# EAGLE schematic countercat_rev2 (EAGLE 6.5.0)
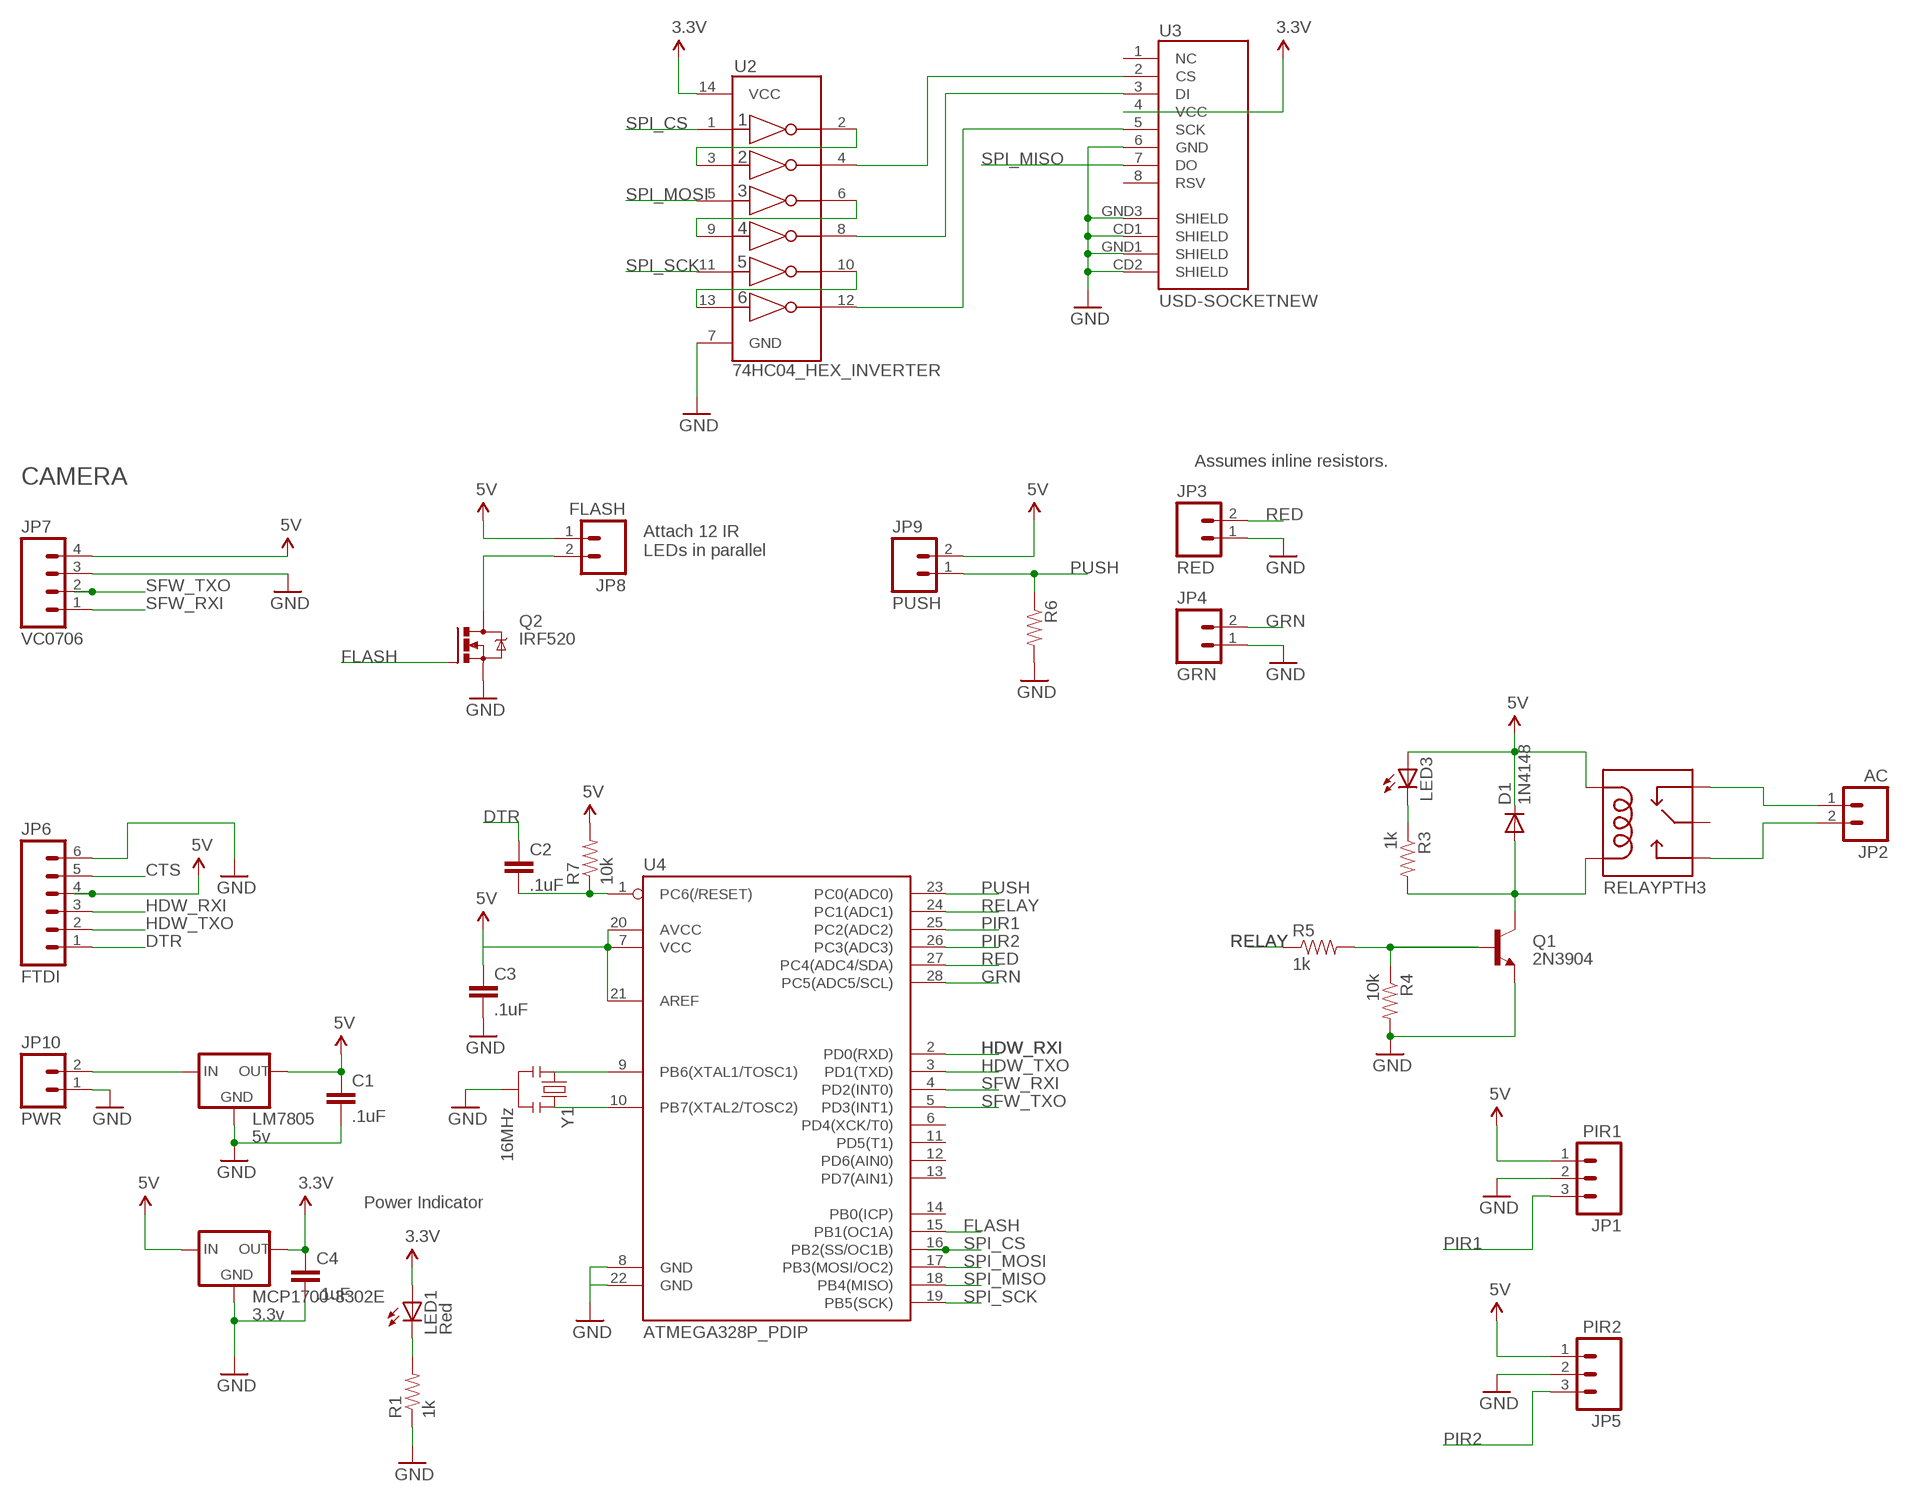
[diagram p0: schematic, sheet 1]

## Parts
C1  .1uF  CAPPTH2  [CAP-PTH-SMALL2]
C2  .1uF  CAPPTH2  [CAP-PTH-SMALL2]
C3  .1uF  CAPPTH2  [CAP-PTH-SMALL2]
C4  .1uF  CAPPTH2  [CAP-PTH-SMALL2]
D1  1N4148  DIODEPTH  [DIODE-1N4001]
JP1  PIR1  M03POLAR  [MOLEX-1X3]
JP2  AC  M025MM  [SCREWTERMINAL-5MM-2]
JP3  RED  M02POLAR  [MOLEX-1X2]
JP4  GRN  M02POLAR  [MOLEX-1X2]
JP5  PIR2  M03POLAR  [MOLEX-1X3]
JP6  FTDI  M06LOCK  [1X06_LOCK]
JP7  VC0706  M04POLAR  [MOLEX-1X4]
JP8  FLASH  M02POLAR  [MOLEX-1X2]
JP9  PUSH  M02POLAR  [MOLEX-1X2]
JP10  PWR  M02POLAR  [MOLEX-1X2]
LED1  Red  LED3MM  [LED3MM]
LED3  LED3MM  [LED3MM]
LM7805  5v  V_REG_78XXSINK  [TO220-IGO]
MCP1700-3302E  3.3v  V_REG_78XXTO-92_UNTESTED  [TO-92]
Q1  2N3904  TRANSISTOR_NPNTO92  [TO-92]
Q2  IRF520  [TO220BV]
R1  1k  RESISTORPTH-1/4W  [AXIAL-0.4]
R3  1k  RESISTORPTH-1/4W  [AXIAL-0.4]
R4  10k  RESISTORPTH-1/4W  [AXIAL-0.4]
R5  1k  RESISTORPTH-1/4W  [AXIAL-0.4]
R6  RESISTORPTH-1/4W  [AXIAL-0.4]
R7  10k  RESISTORPTH-1/4W  [AXIAL-0.4]
U2  74HC04_HEX_INVERTER  [DIL14]
U3  USD-SOCKETNEW  [MICRO-SD-SOCKET-PP]
U4  ATMEGA328P_PDIP  [DIL28-3]
U$2  RELAYPTH3  [RELAY-T9A-2]
Y1  16MHz  RESONATORPTH  [RESONATOR-PTH]

## Nets
3.3V: C4.1 LED1.A MCP1700-3302E.3(OUT) U2.14(VCC) U3.4(VCC)
5V: C1.1 D1.C JP1.1 JP5.1 JP6.4 JP7.4 JP8.1 JP9.2 LED3.A LM7805.OUT MCP1700-3302E.2(IN) R7.P$2 U$2.COIL1
CTS: JP6.5
DTR: C2.1 C2.2 JP6.1 R7.P$1 U4.1(PC6(/RESET))
FLASH: Q2.G U4.15(PB1(OC1A))
GND: C1.2 C3.2 C4.2 JP1.2 JP3.1 JP4.1 JP5.2 JP6.6 JP7.3 JP10.1 LM7805.GND MCP1700-3302E.1(GND) Q1.1(E) Q2.S R1.P$1 R4.P$2 R6.P$2 U2.7(GND) U3.6(GND) U3.CD1(SHIELD) U3.CD2(SHIELD) U3.GND1(SHIELD) U3.GND3(SHIELD) U4.8(GND) U4.22(GND) Y1.2
GRN: JP4.2 U4.28(PC5(ADC5/SCL))
HDW_RXI: JP6.3 U4.2(PD0(RXD))
HDW_TXO: JP6.2 U4.3(PD1(TXD))
N$1: LED3.K(C) R3.P$1
N$3: U4.9(PB6(XTAL1/TOSC1)) Y1.1
N$4: JP8.2 Q2.D
N$5: U2.2(1Y) U2.3(2A)
N$6: JP2.1 U$2.NC
N$7: U4.10(PB7(XTAL2/TOSC2)) Y1.3
N$8: U4.7(VCC) U4.20(AVCC) U4.21(AREF)
N$9: JP2.2 U$2.NO
N$10: D1.A Q1.3(C) R3.P$2 U$2.COIL2
N$11: Q1.2(B) R4.P$1 R5.P$2
N$12: C3.1
N$13: U2.8(4Y) U3.3(DI)
N$14: LED1.K(C) R1.P$2
N$15: U2.12(6Y) U3.5(SCK)
N$16: U2.6(3Y) U2.9(4A)
N$17: U2.10(5Y) U2.13(6A)
N$20: U2.4(2Y) U3.2(CS)
PIR1: JP1.3 U4.25(PC2(ADC2))
PIR2: JP5.3 U4.26(PC3(ADC3))
PUSH: JP9.1 R6.P$1 U4.23(PC0(ADC0))
RED: JP3.2 U4.27(PC4(ADC4/SDA))
RELAY: R5.P$1 U4.24(PC1(ADC1))
SFW_RXI: JP7.1 U4.4(PD2(INT0))
SFW_TXO: JP7.2 U4.5(PD3(INT1))
SPI_CS: U2.1(1A) U4.16(PB2(SS/OC1B))
SPI_MISO: U3.7(DO) U4.18(PB4(MISO))
SPI_MOSI: U2.5(3A) U4.17(PB3(MOSI/OC2))
SPI_SCK: U2.11(5A) U4.19(PB5(SCK))
VB: JP10.2 LM7805.IN
Unconnected: U3.1(NC) U3.8(RSV) U4.6(PD4(XCK/T0)) U4.11(PD5(T1)) U4.12(PD6(AIN0)) U4.13(PD7(AIN1)) U4.14(PB0(ICP)) U$2.MAIN

## Notes on the sheet
- Assumes inline resistors.
- CAMERA
- Attach 12 IR
  LEDs in parallel
- Power Indicator

## Library data of the parts
C1-C4 = SparkFun-Capacitors:CAP: Capacitor Standard 0603 ceramic capacitor, and 0.1" leaded capacitor.
D1 = SparkFun:DIODE: Diode These are standard reverse protection diodes and small signal diodes. SMA package can handle up to about 1A. SOD-323 can handle about 200mA. What the SOD-323 package when ordering, there are some mfgs out there that are 5-pin packages.
JP1 JP5 = SparkFun:M03: Header 3 Standard 3-pin 0.1" header. Use with straight break away headers (SKU : PRT-00116), right angle break away headers (PRT-00553), swiss pins (PRT-00743), machine pins (PRT-00117), and female headers (PRT-00115). Molex polarized connector foot print use with SKU : PRT-08232 with associated crimp pins and housings.
JP2 = NickDC2011Breakouts:M02: Header 2 Standard 2-pin 0.1" header. Use with straight break away headers (SKU : PRT-00116), right angle break away headers (PRT-00553), swiss pins (PRT-00743), machine pins (PRT-00117), and female headers (PRT-00115). Molex polarized connector foot print use with SKU : PRT-08233 with associated crimp pins and housings.
JP3 JP4 JP8-JP10 = SparkFun:M02: Header 2 Standard 2-pin 0.1" header. Use with straight break away headers (SKU : PRT-00116), right angle break away headers (PRT-00553), swiss pins (PRT-00743), machine pins (PRT-00117), and female headers (PRT-00115). Molex polarized connector foot print use with SKU : PRT-08233 with associated crimp pins and housings.
JP6 = NickDC2011Breakouts:M06: Header 6 Standard 6-pin 0.1" header. Use with straight break away headers (SKU : PRT-00116), right angle break away headers (PRT-00553), swiss pins (PRT-00743), machine pins (PRT-00117), and female headers (PRT-00115). Molex polarized connector foot print use with SKU : PRT-08094 with associated crimp pins and housings. NOTES ON THE VARIANTS LOCK and LOCK_LONGPADS... This footprint was designed to help hold the alignment of a through-hole component (i.e. 6-pin header) while soldering it into place. You may notice that each hole has been shifted either up or down by 0.005 of an inch from it's more standard position (which is a perfectly straight line). This slight alteration caused the pins (the squares in the middle) to touch the edges of the holes. Because they are alternating, it causes a "brace" to hold the component in place. 0.005 has proven to be the perfect amount of "off-center" position when using our standard breakaway headers. Although looks a little odd when you look at the bare footprint, once you have a header in there, the alteration is very hard to notice. Also, if you push a header all the way into place, it is covered up entirely on the bottom side. This idea of altering the position of holes to aid alignment will be further integrated into the Sparkfun Library for other footprints. It can help hold any component with 3 or more connection pins.
JP7 = SparkFun-Connectors:M04: Header 4 Standard 4-pin 0.1" header. Use with straight break away headers (SKU : PRT-00116), right angle break away headers (PRT-00553), swiss pins (PRT-00743), machine pins (PRT-00117), and female headers (PRT-00115). Molex polarized connector foot print use with SKU : PRT-08231 with associated crimp pins and housings. 1MM SMD Version SKU: PRT-10208
LED1 = SparkFun-LED:LED: LEDs Standard schematic elements and footprints for 5mm, 3mm, 1206, and 0603 sized LEDs. 5mm - Spark Fun Electronics SKU : COM-00529 (and others)
LED3 = nick_DC2011:LED: LEDs Standard schematic elements and footprints for 5mm, 3mm, 1206, and 0603 sized LEDs. 5mm - Spark Fun Electronics SKU : COM-00529 (and others)
LM7805 MCP1700-3302E = SparkFun-PowerIC:V_REG_78XX: Voltage Regulator Standard 7805 5V regulator. IGO (Input Ground Output). Spark Fun Electronics SKU : COM-00107
Q1 = SparkFun:TRANSISTOR_NPN: Transistor NPN BJT configuration in SOT23 package. MMBT2222 is the common NPN we use. Double check BCE configuration again layout.
Q2 = transistor-power:IRF520: HEXFET Power MOSFET
R1 R3-R7 = SparkFun-Resistors:RESISTOR: Resistor Basic schematic elements and footprints for 0603, 1206, and PTH resistors.
U2 = SparkFun-DigitalIC:74HC04_HEX_INVERTER: 74HC04 Hex Inverter
U3 = SparkFun:USD-SOCKET: microSD Socket Push-push type uSD socket. Schematic element and footprint production proven. Spark Fun Electronics SKU : PRT-00127. tDoc lines correctly indicate media card edge positions when inserting (unlocked, locked, depressed).
U4 = SparkFun-DigitalIC:ATMEGA328P_PDIP: uC used in the Arduino 32kb flash, 1k EEPROM, 2k SRAM This is the through-hole version of this chip.
U$2 = SparkFun:RELAY
Y1 = SparkFun-FreqCtrl:RESONATOR: Resonator Small SMD resonator. Used, eg, on the Arduino Pro/ Pro Mini boards. 8MHz- XTAL-08895 16MHz- XTAL-08900